# EAGLE schematic MPGUINO (EAGLE 5.00)
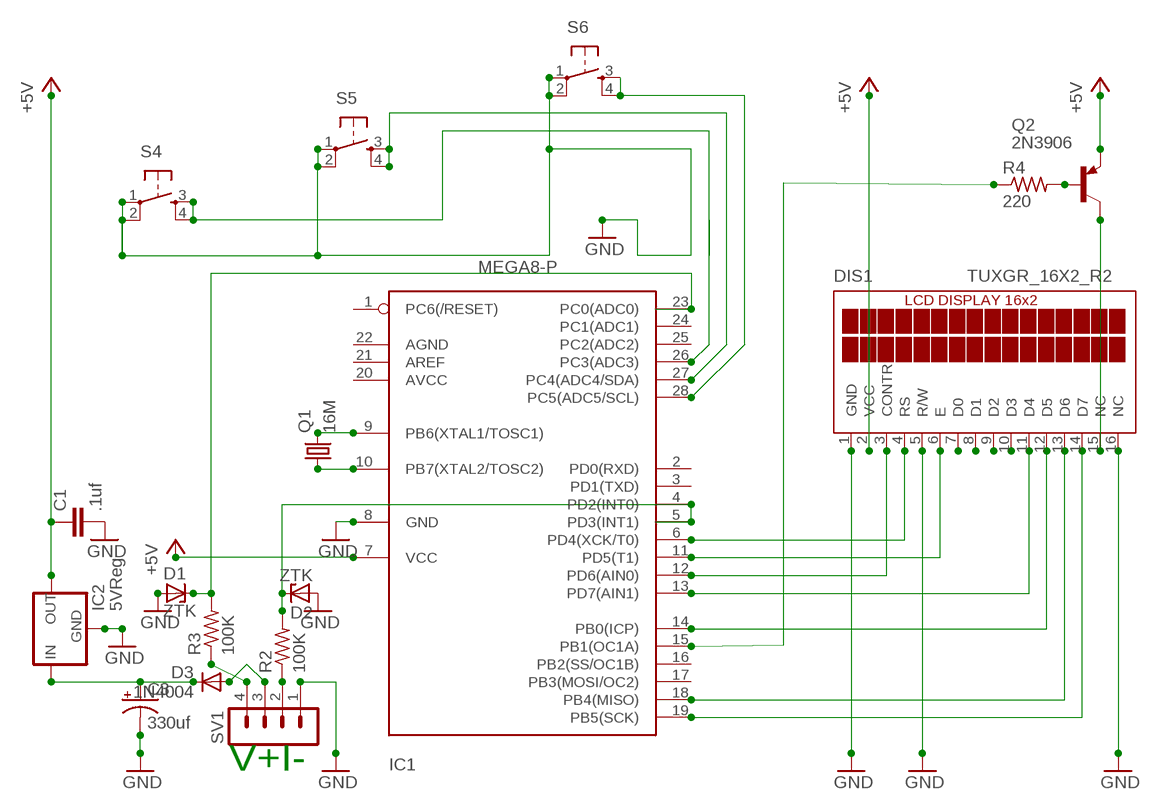
[diagram p0: schematic, sheet 1]

## Parts
C1  .1uf  C-EU050-035X075  [C050-035X075]
C3  330uf  CPOL-USE2-5  [E2-5]
D1  ZTK  [DO35Z10]
D2  ZTK  [DO35Z10]
D3  1N4004  [DO41-10]
DIS1  TUXGR_16X2_R2  [TUXGR_16X2_R2]
IC1  MEGA8-P  [DIL28-3]
IC2  5VReg  78XXL  [78XXL]
Q1  16M  CRYSTALHC49S  [HC49/S]
Q2  2N3906  [TO92]
R2  100K  R-US_0207/12  [0207/12]
R3  100K  R-US_0207/12  [0207/12]
R4  220  R-US_0207/15  [0207/15]
S4  TAC_SWITCHPTH  [TACTILE-PTH]
S5  TAC_SWITCHPTH  [TACTILE-PTH]
S6  TAC_SWITCHPTH  [TACTILE-PTH]
SV1  MA04-1  [MA04-1]

## Nets
+5V: C1.1 DIS1.2(VCC) IC1.7(VCC) IC2.OUT Q2.3(E)
GND: C1.2 C3.- D1.A D2.A DIS1.1(GND) DIS1.5(R/W) DIS1.16(NC) IC1.8(GND) IC2.GND S4.1 S4.2 S5.1 S5.2 S6.1 S6.2 SV1.1
N$1: DIS1.4(RS) IC1.6(PD4(XCK/T0))
N$2: DIS1.6(E) IC1.11(PD5(T1))
N$3: DIS1.3(CONTR) IC1.12(PD6(AIN0))
N$4: DIS1.11(D4) IC1.13(PD7(AIN1))
N$5: DIS1.12(D5) IC1.14(PB0(ICP))
N$6: DIS1.13(D6) IC1.18(PB4(MISO))
N$7: DIS1.14(D7) IC1.19(PB5(SCK))
N$8: C3.+ D3.C IC2.IN
N$9: DIS1.15(NC) Q2.1(C)
N$10: IC1.9(PB6(XTAL1/TOSC1)) Q1.2
N$11: IC1.10(PB7(XTAL2/TOSC2)) Q1.1
N$12: R3.1 SV1.4
N$13: R2.1 SV1.2
N$14: D1.C IC1.23(PC0(ADC0)) R3.2
N$15: IC1.27(PC4(ADC4/SDA)) S5.3 S5.4
N$16: Q2.2(B) R4.2
N$17: IC1.15(PB1(OC1A)) R4.1
N$18: DIS1.7(D0)
N$19: IC1.26(PC3(ADC3)) S4.3 S4.4
N$20: IC1.28(PC5(ADC5/SCL)) S6.3 S6.4
N$21: D3.A SV1.3
N$22: D2.C IC1.4(PD2(INT0)) IC1.5(PD3(INT1)) R2.2
N$23: DIS1.8(D1)
N$24: DIS1.9(D2)
N$25: DIS1.10(D3)
Unconnected: IC1.1(PC6(/RESET)) IC1.2(PD0(RXD)) IC1.3(PD1(TXD)) IC1.16(PB2(SS/OC1B)) IC1.17(PB3(MOSI/OC2)) IC1.21(AREF) IC1.24(PC1(ADC1)) IC1.25(PC2(ADC2))

## Notes on the sheet
- V+I-

## Power pins joined to a net without a drawn wire
AGND: IC1.22(AGND)
AVCC: IC1.20(AVCC)

## Library data of the parts
C1 = rcl:C-EU: CAPACITOR, European symbol
C3 = rcl:CPOL-US: POLARIZED CAPACITOR, American symbol
D1 D2 = diode:ZTK: Z DIODE
D3 = diode:1N4004: DIODE general purpose rectifier, 1 A
DIS1 = display-lcd:TUXGR_16X2_R2: Tuxgraphics LCD display 16x2 characters reflective, without background light Source: tuxgr_12x2_r2.pdf
IC1 = atmel:MEGA8-P: MICROCONTROLLER 8 Kbytes FLASH, 1 kbytes SRAM, 512 bytes EEPROM, USART, 4-channel 10 bit ADC, 2-channel 8 bit ADC Pin compatible with Atmega48, ATMega88, ATMega168 Source: avr.lbr
IC2 = v-reg:78XXL: VOLTAGE REGULATOR
Q1 = crystal:CRYSTAL: CRYSTAL
Q2 = transistor-pnp:2N3906: PNP Transistor
R2-R4 = rcl:R-US_: RESISTOR, American symbol
S4-S6 = SparkFun:TAC_SWITCH: Momentary Switch Button commonly used for reset or general input. Spark Fun Electronics SKU : COM-00097
SV1 = con-lstb:MA04-1: PIN HEADER